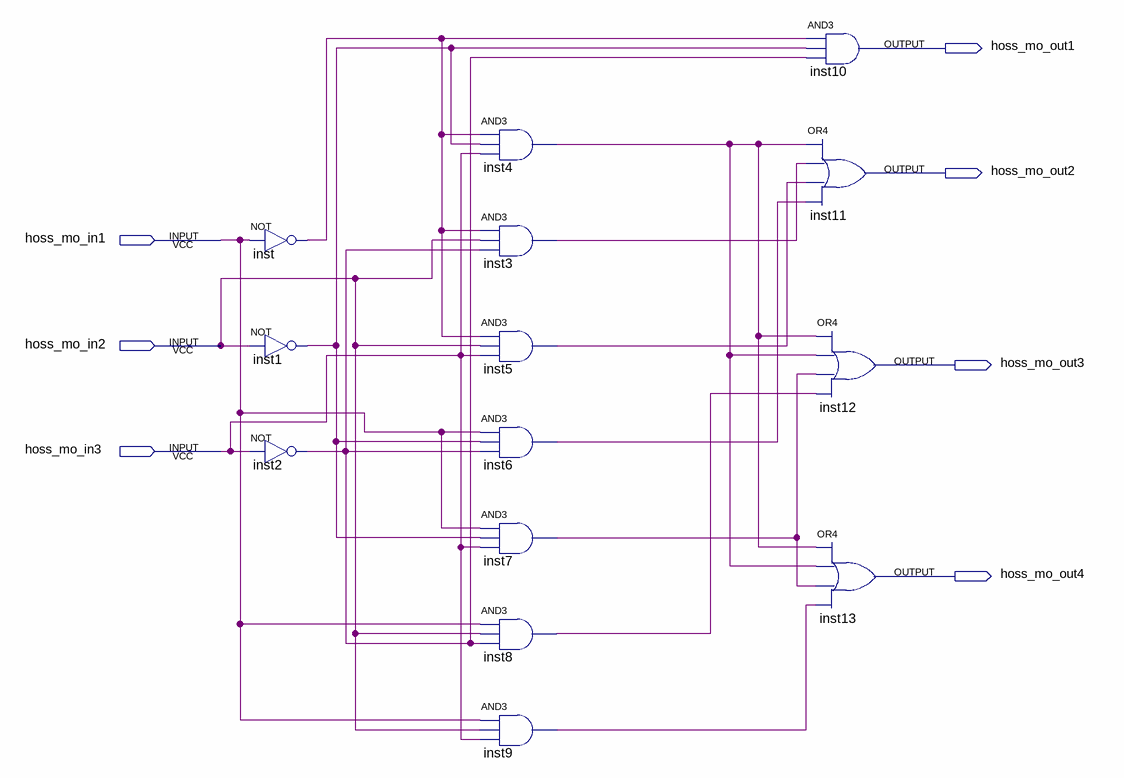
[diagram p0: schematic sheet]
// Quartus schematic supCircuitC.bdf as structural Verilog: 14 symbols, 7 pins
module supCircuitC (
  input  hoss_mo_in1,
  input  hoss_mo_in2,
  input  hoss_mo_in3,
  output hoss_mo_out1,
  output hoss_mo_out2,
  output hoss_mo_out3,
  output hoss_mo_out4
);

  wire inst1_out, inst2_out, inst3_out, inst4_out, inst5_out, inst6_out, inst7_out, inst8_out, inst9_out,
       inst_out;

  not inst (inst_out, hoss_mo_in1);
  not inst1 (inst1_out, hoss_mo_in2);
  not inst2 (inst2_out, hoss_mo_in3);
  and inst4 (inst4_out, inst_out, inst1_out, hoss_mo_in3);
  and inst3 (inst3_out, inst_out, hoss_mo_in2, inst2_out);
  and inst5 (inst5_out, inst_out, hoss_mo_in2, hoss_mo_in3);
  and inst6 (inst6_out, hoss_mo_in1, inst1_out, inst2_out);
  and inst7 (inst7_out, hoss_mo_in1, inst1_out, hoss_mo_in3);
  and inst8 (inst8_out, hoss_mo_in1, hoss_mo_in2, inst2_out);
  and inst9 (inst9_out, hoss_mo_in1, hoss_mo_in2, hoss_mo_in3);
  and inst10 (hoss_mo_out1, inst_out, inst1_out, inst2_out);
  or inst11 (hoss_mo_out2, inst4_out, inst3_out, inst5_out, inst6_out);
  or inst12 (hoss_mo_out3, inst4_out, inst4_out, inst7_out, inst8_out);
  or inst13 (hoss_mo_out4, inst4_out, inst4_out, inst7_out, inst9_out);
endmodule
